# Altium schematic sheet um982.SchDoc
size A4; SheetNumber: 1; SheetTotal: 3
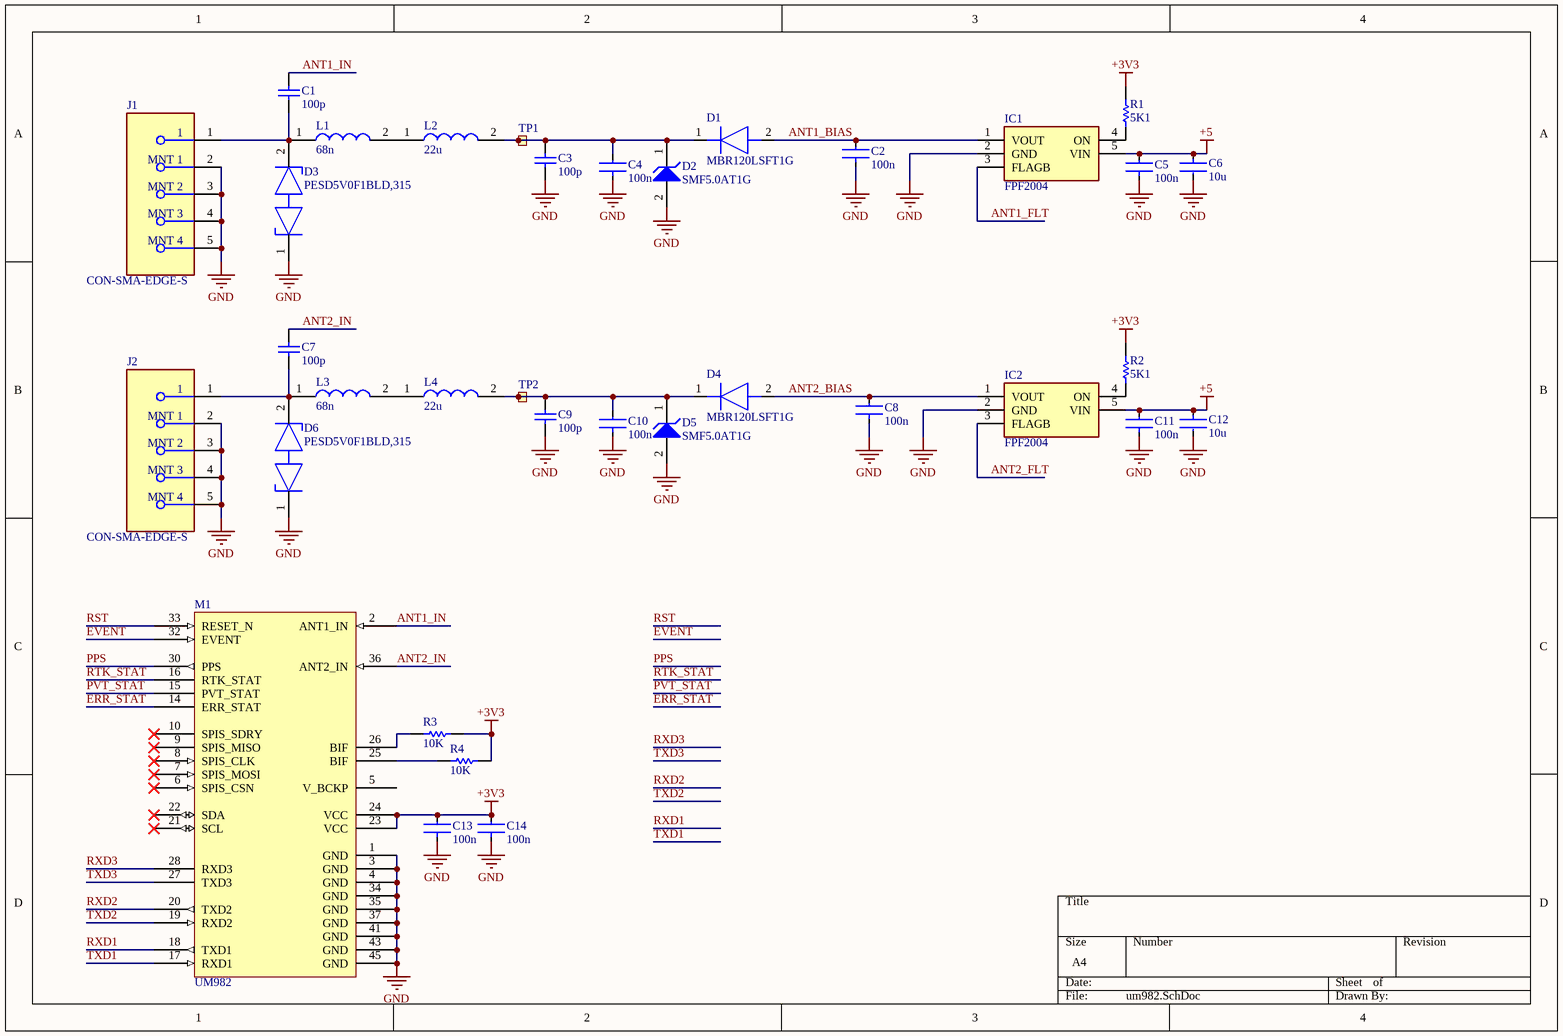
[diagram p0: um982.SchDoc]

## Parts
C1  value 100p  [CAPC1005X55X25ML05T10]  (hidden comment: GRM1555C1H101JA01D)
C2  value 100n  [FP-C1005-050-0_05-IPC_C]  (hidden comment: C1005X7R1H104K050BB)
C3  value 100p  [CAPC1005X55X25ML05T10]  (hidden comment: GRM1555C1H101JA01D)
C4  value 100n  [FP-C1005-050-0_05-IPC_A]  (hidden comment: C1005X7R1H104K050BB)
C5  value 100n  [FP-C1005-050-0_05-IPC_C]  (hidden comment: C1005X7R1H104K050BB)
C6  value 10u  [FP-C1608-080-IPC_A]  (hidden comment: C1608X5R1E106M080AC)
C7  value 100p  [CAPC1005X55X25ML05T10]  (hidden comment: GRM1555C1H101JA01D)
C8  value 100n  [FP-C1005-050-0_05-IPC_C]  (hidden comment: C1005X7R1H104K050BB)
C9  value 100p  [CAPC1005X55X25ML05T10]  (hidden comment: GRM1555C1H101JA01D)
C10  value 100n  [FP-C1005-050-0_05-IPC_A]  (hidden comment: C1005X7R1H104K050BB)
C11  value 100n  [FP-C1005-050-0_05-IPC_C]  (hidden comment: C1005X7R1H104K050BB)
C12  value 10u  [FP-C1608-080-IPC_A]  (hidden comment: C1608X5R1E106M080AC)
C13  value 100n  [FP-C1005-050-0_05-IPC_A]  (hidden comment: C1005X7R1H104K050BB)
C14  value 100n  [FP-C1005-050-0_05-IPC_A]  (hidden comment: C1005X7R1H104K050BB)
D1  MBR120LSFT1G  [SODFL3616X98N]
D2  SMF5.0AT1G  [ONSC-SOD-123FL-2-498_V]
D3  PESD5V0F1BLD,315  [FP-SOD882D-MFG]
D4  MBR120LSFT1G  [SODFL3616X98N]
D5  SMF5.0AT1G  [ONSC-SOD-123FL-2-498_V]
D6  PESD5V0F1BLD,315  [FP-SOD882D-MFG]
IC1  FPF2004  [SOT65P210X110-5N]
IC2  FPF2004  [SOT65P210X110-5N]
J1  CON-SMA-EDGE-S  [FP-CON-SMA-EDGE-S-MFG]
J2  CON-SMA-EDGE-S  [FP-CON-SMA-EDGE-S-MFG]
L1  value 68n  [LQG15WH0N7B02D]  (hidden comment: LQG15HS68NJ02D)
L2  value 22u  [INDM4532X340N]  (hidden comment: NL453232T-220J-PF)
L3  value 68n  [LQG15WH0N7B02D]  (hidden comment: LQG15HS68NJ02D)
L4  value 22u  [INDM4532X340N]  (hidden comment: NL453232T-220J-PF)
M1  UM982  [UM982]
R1  value 5K1  [RESC1005X40X25NL05T10]  (hidden comment: RC0402FR-075K1L)
R2  value 5K1  [RESC1005X40X25NL05T10]  (hidden comment: RC0402FR-075K1L)
R3  value 10K  [RESC1005X40X25LL05T10]  (hidden comment: RC0402FR-0710KL)
R4  value 10K  [RESC1005X40X25LL05T10]  (hidden comment: RC0402FR-0710KL)
TP1  Ø1.0mm,SMD  [TP_SMD_Ø1.0mm]  (value not drawn)  (no BOM)
TP2  Ø1.0mm,SMD  [TP_SMD_Ø1.0mm]  (value not drawn)  (no BOM)

## Nets
+3V3: C13.2 C14.2 M1.23(VCC) M1.24(VCC) R1.1 R2.1 R3.1 R4.1
+5: C5.2 C6.1 C11.2 C12.1 IC1.5(VIN) IC2.5(VIN)
GND: C2.1 C3.2 C4.1 C5.1 C6.2 C8.1 C9.2 C10.1 C11.1 C12.2 C13.1 C14.1 D2.2(A) D3.1(cathode(diode_1)) D5.2(A) D6.1(cathode(diode_1)) IC1.2(GND) IC2.2(GND) J1.2(MNT_1) J1.3(MNT_2) J1.4(MNT_3) J1.5(MNT_4) J2.2(MNT_1) J2.3(MNT_2) J2.4(MNT_3) J2.5(MNT_4) M1.1(GND) M1.3(GND) M1.4(GND) M1.34(GND) M1.35(GND) M1.37(GND) M1.41(GND) M1.43(GND) M1.45(GND)
ANT1_BIAS: C2.2 D1.2(A) IC1.1(VOUT)
ANT1_FLT: IC1.3(FLAGB)
ANT1_IN: C1.2 M1.2(ANT1_IN)
ANT2_BIAS: C8.2 D4.2(A) IC2.1(VOUT)
ANT2_FLT: IC2.3(FLAGB)
ANT2_IN: C7.2 M1.36(ANT2_IN)
ERR_STAT: M1.14(ERR_STAT)
EVENT: M1.32(EVENT)
PPS: M1.30(PPS)
PVT_STAT: M1.15(PVT_STAT)
RST: M1.33(RESET_N)
RTK_STAT: M1.16(RTK_STAT)
RXD1: M1.18(TXD1)
RXD2: M1.20(TXD2)
RXD3: M1.28(RXD3)
TXD1: M1.17(RXD1)
TXD2: M1.19(RXD2)
TXD3: M1.27(TXD3)
NetC1_1: C1.1 D3.2(cathode(diode_2)) J1.1 L1.1
NetC3_1: C3.1 C4.2 D1.1(K) D2.1(K) L2.2 TP1.1
NetC7_1: C7.1 D6.2(cathode(diode_2)) J2.1 L3.1
NetC9_1: C9.1 C10.2 D4.1(K) D5.1(K) L4.2 TP2.1
NetIC1_4: IC1.4(ON) R1.2
NetIC2_4: IC2.4(ON) R2.2
NetL1_2: L1.2 L2.1
NetL3_2: L3.2 L4.1
NetM1_25: M1.25(BIF) R4.2
NetM1_26: M1.26(BIF) R3.2

Not connected (* = marked no-connect by the designer): M1 5(V_BCKP) 6(SPIS_CSN)* 7(SPIS_MOSI)* 8(SPIS_CLK)* 9(SPIS_MISO)* 10(SPIS_SDRY)* 21(SCL)* 22(SDA)*

## Library data of the parts
C1 C3 C7 C9 = CMP-2008-03915-1: Manufacturer: Murata; Part Number: GRM1555C1H101JA01D
C2 C4 C5 C8 C10 C11 C13 C14 = CMP-2000-05393-2: Multilayer Ceramic Capacitors 100nF ±10% 50V X7R SMD 0402; Voltage: 50V; Dielectric Material: Ceramic; Min Operating Temperature: -55°C; Depth: 0.5mm; Radiation Hardening: No; RoHS Compliant: Yes; Voltage Rating (DC): 50V; Lead Free: Lead Free; Resistor Type: Ceramic; Height: 0.5mm; Dielectric: X7R; Thickness: 0.022inch; Case/Package: 0402; Case Code (Metric): 1005; Termination: SMD/SMT; Capacitance: 100nF; Packaging: Tape and Reel; Max Operating Temperature: 125°C; Mount: Surface Mount; Package Quantity: 1; Width: 0.02inch; Weight: 2.3E-05oz; Voltage Rating: 50V; Tolerance: 10%; Construction: Flat; Case Code (Imperial): 0402; Length: 1mm; REACH SVHC: No SVHC; Series: C
C6 C12 = CMP-2000-05442-2: CAP CER 10UF 25V X5R 0603; Dielectric Material: Ceramic; Tolerance: 20%; Dielectric: X5R; Length: 1.6mm; Termination: SMD/SMT; Depth: 0.8mm; RoHS Compliant: Yes; Construction: Flat; Weight: 7.1E-05oz; Thickness: 0.039inch; Packaging: Tape and Reel; Min Operating Temperature: -55°C; Case Code (Imperial): 0603; Case/Package: 0603; Height: 0.8mm; Case Code (Metric): 1608; Voltage Rating: 25V; Resistor Type: Ceramic; Voltage Rating (DC): 25V; Max Operating Temperature: 85°C; REACH SVHC: No SVHC; Lead Free: Lead Free; Series: C; Width: 0.8mm; Mount: Surface Mount; Package Quantity: 1; Capacitance: 10uF
D1 D4 = MBR120LSFT1G: Diode; Manufacturer_Name: onsemi; Datasheet Link: https://www.onsemi.com/pub/Collateral/MBR120LSFT1-D.PDF; Height: 0.98mm; Manufacturer_Part_Number: MBR120LSFT1G; Mouser Part Number: 863-MBR120LSFT1G; Mouser Price/Stock: https://www.mouser.co.uk/ProductDetail/onsemi/MBR120LSFT1G?qs=3JMERSakebpX1t8rvRkaxg%3D%3D; Arrow Part Number: MBR120LSFT1G; Arrow Price/Stock: https://www.arrow.com/en/products/mbr120lsft1g/on-semiconductor?utm_currency=USD&region=nac
D2 D5 = CMP-1061-00612-1: 200 W Transient Voltage Suppressor, 2-Pin SOD-123FL, Pb-Free, Tape and Reel; Manufacturer: On Semiconductor; Direction: Unidirectional; IR Max (uA): 400; V(BR) Typ (V): 6.7; PackageDescription: 2-Pin SOD, Body 1.65 x 2.7 mm; PartNumber: SMF5.0AT1G; ComponentLink3Description: Package Specification; ComponentLink3URL: http://www.onsemi.com/pub_link/Collateral/498-01.PDF; PackageVersion: Rev. D, 05/2013; Mounting Technology: Surface Mount; PackageReference: SOD-123FL-2-498; ComponentLink2URL: http://www.onsemi.com/pub_link/Collateral/SMF5.0AT1-D.PDF; DatasheetVersion: Rev. 7; ComponentLink1Description: Manufacturer URL; Packing: Tape and Reel; RoHS: Pb-Free; ComponentLink1URL: http://www.onsemi.com/; ComponentLink2Description: Datasheet
D3 D6 = CMP-14432-000003-1: TVS DIODE 5.5V 15V 2DFN1006D; RoHS Compliant: Yes
IC1 IC2 = FPF2004: Integrated Circuit; Manufacturer_Name: onsemi; Datasheet Link: https://www.onsemi.com/pub/Collateral/FPF2001-D.PDF; Height: 1.1mm; Manufacturer_Part_Number: FPF2004; Mouser Part Number: 512-FPF2004; Mouser Price/Stock: https://www.mouser.co.uk/ProductDetail/onsemi-Fairchild/FPF2004?qs=lYuAOLy5nvYlXtSUPYB80A%3D%3D; Arrow Part Number: FPF2004; Arrow Price/Stock: https://www.arrow.com/en/products/fpf2004/on-semiconductor
J1 J2 = CMP-204357-000001-1: CONN SMA JACK STR EDGE MNT; Manufacturer: RF Solutions Ltd.; Impedance: 50Ω; Conn Orientation: Right Angle; Is Female: yes; Number Of Contacts: 1; Frequency: 18GHz; Shielding: true; Category: Conn; ComponentLink2URL: https://www.rfsolutions.co.uk/downloads/1498648656DS-CON-EDGE-SMA-4.pdf; Octopart: https://octopart.com/con-sma-edge-s-rf+solutions-70967450; Package: CONN_JACK; Manufacturer Part Number: CON-SMA-EDGE-S; Height: 6.35mm; Device Class L1: Connectors; Footprint Url: https://forum.upverter.com/uploads/default/original/3X/b/e/be75b907af57498775929d6d9099689c472e0307.pdf; Contact Material: Gold; ComponentLink2Description: Datasheet; Device Class L2: RF / Coaxial Connectors; RoHS: TRUE; Device Class L3: unset; Digikey Description: CONN SMA JACK STR EDGE MNT; Lead Free: Yes; Automotive: No
L1 L3 = LQG15HS68NJ02D: Inductor; Manufacturer_Name: Murata Electronics; Datasheet Link: https://search.murata.co.jp/Ceramy/image/img/P02/JELF243B-0010.pdf; Height: 0.6mm; Manufacturer_Part_Number: LQG15HS68NJ02D; Mouser Part Number: 81-LQG15HS68NJ02D; Mouser Price/Stock: https://www.mouser.co.uk/ProductDetail/Murata-Electronics/LQG15HS68NJ02D?qs=%252BvdzeT3otYvc8aHGlFkb4Q%3D%3D; Arrow Part Number: LQG15HS68NJ02D; Arrow Price/Stock: https://www.arrow.com/en/products/lqg15hs68nj02d/murata-manufacturing?region=nac
L2 L4 = NL453232T-220J-PF: Inductor; Manufacturer_Name: TDK; Datasheet Link: https://product.tdk.com/system/files/dam/doc/product/inductor/inductor/smd/catalog/inductor_commercial_standard_nl453232_en.pdf; Height: 3.4mm; Manufacturer_Part_Number: NL453232T-220J-PF; Mouser Part Number: 810-NL453232T-220JPF; Mouser Price/Stock: https://www.mouser.co.uk/ProductDetail/TDK/NL453232T-220J-PF?qs=qikLf3I1oVVds9cZ5k413A%3D%3D; Arrow Part Number: NL453232T-220J-PF; Arrow Price/Stock: https://www.arrow.com/en/products/nl453232t-220j-pf/tdk
M1 = UM982: All-constellation Multi-frequencyHigh Precision Positioning & Heading Module
R1 R2 = CMP-2002-07753-1: Manufacturer: Yageo / Phycomp; Part Number: RC0402FR-075K1L
R3 R4 = CMP-2002-07353-1: Manufacturer: Yageo / Phycomp; Part Number: RC0402FR-0710KL
TP1 TP2 = TP_SMD_Ø1.0MM: 1.0mm circular SMD testpad; Manufacturer: Nordic Semiconductor; Manufacturer Part Number: N.A.; Pad Count: 1; Part Number: TP_SMD_Ø1.0MM; LatestRevisionDate: 2013-06-11; Published: 2013-06-11; Value: Ø1.0mm,SMD; Note: N.A.; Artikkelnr Noca: N.A.; Footprint Doc: TP_SMD_Ø1.0mm; Part number IPS: N.A.; ComponentLink1URL: N.A.; ComponentLink1Description: Datasheet; ComponentLink2URL: N.A.; ComponentLink2Description: Supplier link; HelpURL: N.A.; Supplier 1: N.A.; Supplier Part Number 1: N.A.; Supplier 2: N.A.; Supplier Part Number 2: N.A.; Component Class: Connectors; PartId: 100500475